# Altium schematic sheet JacdacRgbLedBar10 58.SchDoc: Complete design
size A4; DocumentNumber: 1; SheetNumber: 1; SheetTotal: 1; VersionControl_RevNumber: 1
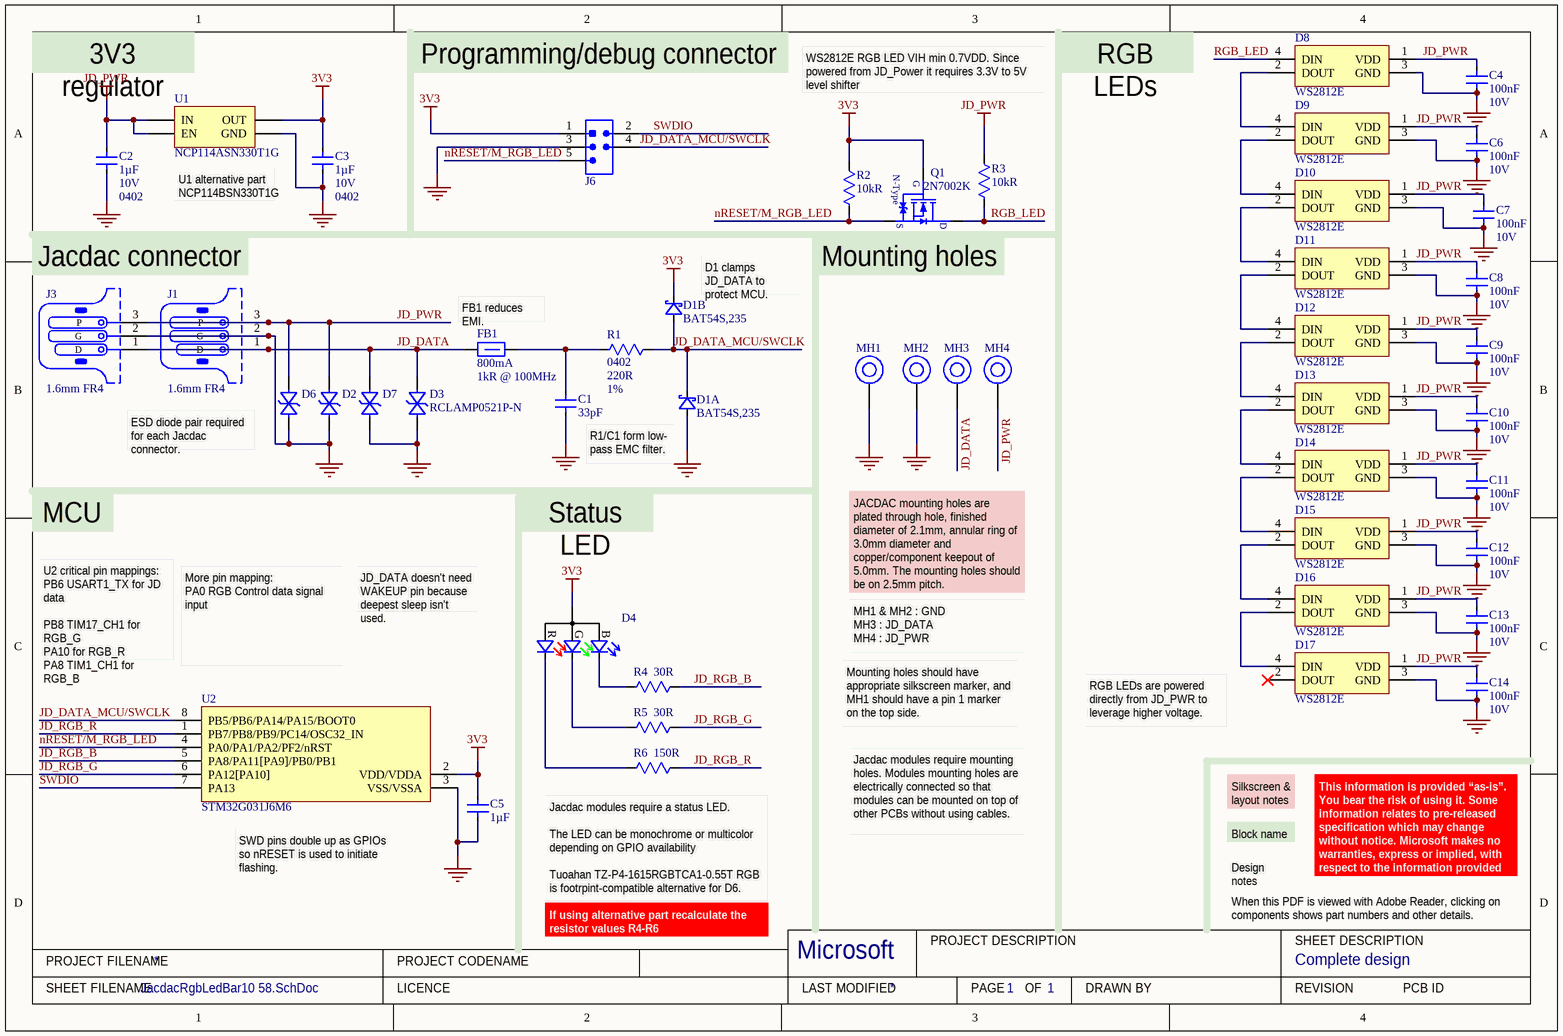
[diagram p0: JacdacRgbLedBar10 58.SchDoc]

## Parts
C1  Capacitance: 33pF  [C0402_0.55MM - without outline]  (hidden comment: CL05C330JB51PNC)
C2  Capacitance: 1µF  Voltage Rating: 10V  Case Code (Imperial): 0402  [C0402_0.55MM - without outline]  (hidden comment: CL05A105KP5NNNC)
C3  Capacitance: 1µF  Voltage Rating: 10V  Case Code (Imperial): 0402  [C0402_0.55MM - without outline]  (hidden comment: CL05A105KP5NNNC)
C4  Capacitance: 100nF  Voltage Rating: 10V  [C0402_0.55MM - without outline]  (hidden comment: CL05B104KP5NNNC)
C5  Capacitance: 1µF  [C0402_0.55MM - without outline]  (hidden comment: CL05A105KP5NNNC)
C6  Capacitance: 100nF  Voltage Rating: 10V  [C0402_0.55MM - without outline]  (hidden comment: CL05B104KP5NNNC)
C7  Capacitance: 100nF  Voltage Rating: 10V  [C0402_0.55MM - without outline]  (hidden comment: CL05B104KP5NNNC)
C8  Capacitance: 100nF  Voltage Rating: 10V  [C0402_0.55MM - without outline]  (hidden comment: CL05B104KP5NNNC)
C9  Capacitance: 100nF  Voltage Rating: 10V  [C0402_0.55MM - without outline]  (hidden comment: CL05B104KP5NNNC)
C10  Capacitance: 100nF  Voltage Rating: 10V  [C0402_0.55MM - without outline]  (hidden comment: CL05B104KP5NNNC)
C11  Capacitance: 100nF  Voltage Rating: 10V  [C0402_0.55MM - without outline]  (hidden comment: CL05B104KP5NNNC)
C12  Capacitance: 100nF  Voltage Rating: 10V  [C0402_0.55MM - without outline]  (hidden comment: CL05B104KP5NNNC)
C13  Capacitance: 100nF  Voltage Rating: 10V  [C0402_0.55MM - without outline]  (hidden comment: CL05B104KP5NNNC)
C14  Capacitance: 100nF  Voltage Rating: 10V  [C0402_0.55MM - without outline]  (hidden comment: CL05B104KP5NNNC)
D1  Manufacturer Part Number: BAT54S,235  [NXP-BAT54S-TO-236AB - without outline]  (hidden comment: BAT54S)  (parts A,B of 2)
D2  RCLAMP0521P-N  [TVS 0402 - without outline]  (value not drawn)
D3  RCLAMP0521P-N  [TVS 0402 - without outline]
D4  TZ-P4-1615RGBTCA1-0.55T  [TZ-P4-1615RGBTCA1-0.55T]  (value not drawn)
D6  RCLAMP0521P-N  [TVS 0402 - without outline]  (value not drawn)
D7  RCLAMP0521P-N  [TVS 0402 - without outline]  (value not drawn)
D8  WS2812E  [WS2812E-5050]
D9  WS2812E  [WS2812E-5050]
D10  WS2812E  [WS2812E-5050]
D11  WS2812E  [WS2812E-5050]
D12  WS2812E  [WS2812E-5050]
D13  WS2812E  [WS2812E-5050]
D14  WS2812E  [WS2812E-5050]
D15  WS2812E  [WS2812E-5050]
D16  WS2812E  [WS2812E-5050]
D17  WS2812E  [WS2812E-5050]
FB1  Current Rating: 800mA  Impedance: 1kR @ 100MHz  [TDK MPZ1608 0.8mm - without outline]  (hidden comment: TDK MPZ1608S102ATA00)
J1  PCB Type: 1.6mm FR4  [JACDAC_EDGE_CONNECTOR_NO_TRACES]  (hidden comment: 3 pin JACDAC edge connector)  (no BOM)
J3  PCB Type: 1.6mm FR4  [JACDAC_EDGE_CONNECTOR_NO_TRACES]  (hidden comment: 3 pin JACDAC edge connector)  (no BOM)
J6  Hack Connect Mini 1.27 mm pitch 2-row  [HACK_CONNECT_MINI_5_X_1_27]  (value not drawn)  (no BOM)
MH1  MH_5.0MMK_3.0MMC_2.1MMD_PTH  [MH_5.0MMK_3.0MMC_2.1MMD_PTH]  (value not drawn)  (no BOM)
MH2  MH_5.0MMK_3.0MMC_2.1MMD_PTH  [MH_5.0MMK_3.0MMC_2.1MMD_PTH]  (value not drawn)  (no BOM)
MH3  MH_5.0MMK_3.0MMC_2.1MMD_PTH  [MH_5.0MMK_3.0MMC_2.1MMD_PTH]  (value not drawn)  (no BOM)
MH4  MH_5.0MMK_3.0MMC_2.1MMD_PTH  [MH_5.0MMK_3.0MMC_2.1MMD_PTH]  (value not drawn)  (no BOM)
Q1  2N7002K  [SOT-23]
R1  Case Code (Imperial): 0402  Resistance: 220R  Tolerance: 1%  [R0402 - Without outline]  (hidden comment: RC0402FR-07220RL)
R2  Resistance: 10kR  [R0402 - Without outline]  (hidden comment: 10k)
R3  Resistance: 10kR  [R0402 - Without outline]  (hidden comment: 10k)
R4  Resistance: 30R  [R0402 - Without outline]  (hidden comment: RC0402FR-0730RL)
R5  Resistance: 30R  [R0402 - Without outline]  (hidden comment: RC0402FR-0730RL)
R6  Resistance: 150R  [R0402 - Without outline]  (hidden comment: RC0402FR-07150RL)
U1  LDO 3.3V/300 mA  [ON_SEMI-SOT23-5 - without outline]  (value not drawn)
U2  STM32G031J6M6  [8-SOIC]

## Nets
3V3: C3.2 C5.2 D1.2(K) D4.1(A) J6.1(VCC) Q1.1(G) R2.1 U1.5(OUT) U2.2(VDD/VDDA)
GND: C1.1 C2.1 C3.1 C4.1 C5.1 C6.1 C7.1 C8.1 C9.1 C10.1 C11.1 C12.1 C13.1 C14.1 D1.1(A) D2.2(A) D3.2(A) D6.2(A) D7.2(A) D8.3(GND) D9.3(GND) D10.3(GND) D11.3(GND) D12.3(GND) D13.3(GND) D14.3(GND) D15.3(GND) D16.3(GND) D17.3(GND) J1.2(G) J3.2(G) J6.3(GND) MH1.1 MH2.1 U1.2(GND) U2.3(VSS/VSSA)
JD_PWR: C2.2 C4.2 C6.2 C7.2 C8.2 C9.2 C10.2 C11.2 C12.2 C13.2 C14.2 D2.1(K) D6.1(K) D8.1(VDD) D9.1(VDD) D10.1(VDD) D11.1(VDD) D12.1(VDD) D13.1(VDD) D14.1(VDD) D15.1(VDD) D16.1(VDD) D17.1(VDD) J1.3(P) J3.3(P) MH4.1 R3.1 U1.1(IN) U1.3(EN)
JD_DATA: D3.1(K) D7.1(K) FB1.1 J1.1(D) J3.1(D) MH3.1
JD_DATA_MCU/SWCLK: D1.3(K) J6.4(SWCLK) R1.1 U2.8(PB5/PB6/PA14/PA15/BOOT0)
JD_RGB_B: R4.2 U2.5(PA8/PA11[PA9]/PB0/PB1)
JD_RGB_G: R5.2 U2.6(PA12[PA10])
JD_RGB_R: R6.2 U2.1(PB7/PB8/PB9/PC14/OSC32_IN)
nRESET/M_RGB_LED: J6.5(RESET) Q1.2(S) R2.2 U2.4(PA0/PA1/PA2/PF2/nRST)
RGB_LED: D8.4(DIN) Q1.3(D) R3.2
SWDIO: J6.2(SWDIO) U2.7(PA13)
NetC1_2: C1.2 FB1.2 R1.2
NetD4_2: D4.2(R) R6.1
NetD4_3: D4.3(G) R5.1
NetD4_4: D4.4(B) R4.1
NetD8_2: D8.2(DOUT) D9.4(DIN)
NetD9_2: D9.2(DOUT) D10.4(DIN)
NetD10_2: D10.2(DOUT) D11.4(DIN)
NetD11_2: D11.2(DOUT) D12.4(DIN)
NetD12_2: D12.2(DOUT) D13.4(DIN)
NetD13_2: D13.2(DOUT) D14.4(DIN)
NetD14_2: D14.2(DOUT) D15.4(DIN)
NetD15_2: D15.2(DOUT) D16.4(DIN)
NetD16_2: D16.2(DOUT) D17.4(DIN)

Not connected (* = marked no-connect by the designer): D17 2(DOUT)*

## Notes on the sheet
- (near U1) 3V3 regulator
- Programming/debug connector
- WS2812E RGB LED VIH min 0.7VDD. Since powered from JD_Power it requires 3.3V to 5V level shifter
- RGB LEDs
- U1 alternative part
  NCP114BSN330T1G
- Jacdac connector
- (near D1) D1 clamps JD_DATA to protect MCU.
- (near Q1) Mounting holes
- (near FB1) FB1 reduces EMI.
- (near D6) ESD diode pair required for each Jacdac connector.
- R1/C1 form low-
  pass EMC filter.
- MCU
- Status LED
- U2 critical pin mappings:
  PB6 USART1_TX for JD data
  PB8 TIM17_CH1 for RGB_G
  PA10 for RGB_R
  PA8 TIM1_CH1 for RGB_B
- JD_DATA doesn't need WAKEUP pin because deepest sleep isn't used.
- JACDAC mounting holes are plated through hole, finished diameter of 2.1mm, annular ring of 3.0mm diameter and copper/component keepout of 5.0mm. The mounting holes should be on 2.5mm pitch.
- MH1 & MH2 : GND
  MH3 : JD_DATA
  MH4 : JD_PWR
- More pin mapping:
  PA0 RGB Control data signal input
- Mounting holes should have appropriate silkscreen marker, and MH1 should have a pin 1 marker on the top side.
- RGB LEDs are powered directly from JD_PWR to leverage higher voltage.
- Jacdac modules require mounting holes. Modules mounting holes are electrically connected so that modules can be mounted on top of other PCBs without using cables.
- Block name
- Silkscreen & layout notes
- (near U2) SWD pins double up as GPIOs so nRESET is used to initiate flashing.
- Tuoahan TZ-P4-1615RGBTCA1-0.55T RGB is footrpint-compatible alternative for D6.
- (near R6) Jacdac modules require a status LED.
  The LED can be monochrome or multicolor depending on GPIO availability
- Design notes
- When this PDF is viewed with Adobe Reader, clicking on components shows part numbers and other details.
- This information is provided “as-is”. You bear the risk of using it. Some information relates to pre-released specification which may change without notice. Microsoft makes no warranties, express or implied, with respect to the information provided here.
- If using alternative part recalculate the resistor values R4-R6
- PROJECT FILENAME
- PROJECT CODENAME
- Microsoft
- PROJECT DESCRIPTION
- SHEET DESCRIPTION
- SHEET FILENAME
- LICENCE
- LAST MODIFIED
- PAGE
- OF
- DRAWN BY
- REVISION
- PCB ID
- (in symbol 2N7002K (2)) N-Type

## Library data of the parts
C1 = CL05C330JB51PNC: CAP CER 33PF 50V NP0 0402; Manufacturer: Samsung; Tolerance: 5%; Supplier 1: Digi-Key; Manufacturer Part Number: CL05C330JB51PNC; RoHS: Yes; Category: Capacitors; Stock 1: 250654; Pricing 1: 1=0.10000, 10=0.07500, 50=0.04060, 100=0.03320, 500=0.02374, 1000=0.01865, 2500=0.01696, 5000=0.01560 (USD); Mount: Surface Mount; Case/Package: 0402; Case Code (Metric): 1005; Min Operating Temperature: -55°C; Max Operating Temperature: 125°C; Packaging: Tape and Reel; Length: 0.039inch; Width: 0.02inch; Thickness: 0.022inch; Ratings: AEC-Q200; Lead Free: Lead Free; ComponentLink1URL: http://www.samsungsem.com/kr/support/library/product-catalog/mlcc.jsp; ComponentLink1Description: Samsung datasheet online; Supplier 2: Mouser; Stock 2: 97900; Pricing 2: 1=0.11000, 10=0.08200, 100=0.03600, 500=0.02600, 1000=0.02000, 2500=0.01800 (USD); Supplier 3: Future Electronics; Stock 3: 100000; Pricing 3: 10000=0.00780 (USD); Supplier Part Number 3: 6022520; Supplier Part Number 2: 187-CL05C330JB51PNC; Checked: ?; Created: DG; Supplier Part Number 1: 1276-6515-1-ND; Voltage Rating: 50V; Case Code (Imperial): 0402
C2 C3 C5 = CL05A105KP5NNNC: CAP CER 1UF 10V X5R 0402; Manufacturer: Samsung; Material: Ceramic; Tolerance: 10%; Supplier 1: Digi-Key; Manufacturer Part Number: CL05A105KP5NNNC; RoHS: Yes; Category: Capacitors; Stock 1: 5705569; Pricing 1: 1=0.10000, 10=0.03900, 50=0.02100, 100=0.01720, 500=0.01228, 1000=0.00965, 2500=0.00877, 5000=0.00807 (USD); Mount: Surface Mount; Case/Package: 0402; Case Code (Metric): 1005; Contact Plating: Tin; Min Operating Temperature: -55°C; Max Operating Temperature: 85°C; Dielectric: X5R; Package Quantity: 1; Packaging: Tape and Reel; Length: 1mm; Height: 0.5mm; Width: 0.02inch; Thickness: 0.022inch; Depth: 0.5mm; Radiation Hardening: No; ComponentLink1URL: https://datasheet.ciiva.com/15195/getdatasheetpartid-358390-15195630.pdf; ComponentLink1Description: Online datasheet; Supplier 2: Mouser; Stock 2: 928941; Pricing 2: 1=0.10000, 10=0.04200, 100=0.01800, 500=0.01300, 1000=0.01000, 2500=0.00900 (USD); Supplier 3: Farnell; Stock 3: 53670; Pricing 3: 10=0.02450, 100=0.02000, 500=0.01310, 2500=0.00920, 5000=0.00810, 10000=0.00640, 50000=0.00490 (GBP); Supplier Part Number 3: 3013329; Supplier Part Number 2: 187-CL05A105KP5NNNC; Supplier Part Number 1: 1276-1076-1-ND; Created: DG; Checked: ?
  C5: Voltage Rating: 10V; Case Code (Imperial): 0402
C4 C6-C14 = CL05B104KP5NNNC: CAP CER 0.1UF 10V X7R 0402; Manufacturer: Samsung; Tolerance: 10%; Supplier 1: Digi-Key; Manufacturer Part Number: CL05B104KP5NNNC; RoHS: Yes; Category: Ceramic Capacitors; Stock 1: 17321183; Pricing 1: 1=0.10000, 10=0.02500, 50=0.01380, 100=0.01130, 500=0.00804, 1000=0.00632, 2500=0.00575, 5000=0.00529 (USD); Mount: Surface Mount; Case/Package: 0402; Case Code (Imperial): 0402; Case Code (Metric): 1005; Contact Plating: Tin; Min Operating Temperature: -55°C; Max Operating Temperature: 125°C; Package Quantity: 1; Packaging: Tape and Reel; Dielectric: X7R; Length: 1mm; Width: 0.02inch; Height: 0.5mm; Thickness: 0.022inch; Depth: 0.5mm; Radiation Hardening: No; ComponentLink1URL: https://datasheet.ciiva.com/15165/getdatasheetpartid-37100-15165107.pdf; ComponentLink1Description: Samsung datasheet online; Supplier 2: Mouser; Stock 2: 984124; Pricing 2: 10000=0.00400, 20000=0.00400, 50000=0.00400 (USD); Supplier 3: Farnell; Stock 3: 39022; Pricing 3: 10=0.01620, 100=0.01310, 500=0.00740, 2500=0.00600, 5000=0.00470, 10000=0.00400, 50000=0.00320 (GBP); Supplier 4: Newark; Stock 4: 56730; Pricing 4: 1=0.09000, 25=0.02300, 100=0.01000, 250=0.00900, 500=0.00700, 1000=0.00500, 2500=0.00500 (USD); Supplier 5: Future Electronics; Stock 5: 20877033; Pricing 5: 1=0.00460, 500=0.00340, 1500=0.00320, 2500=0.00310, 5000=0.00300 (USD); Supplier Part Number 5: 9032525; Supplier Part Number 4: 82AC9219; Supplier Part Number 2: 187-CL05B104KP5NNNC; Supplier Part Number 1: 1276-1002-1-ND; Created: DG; Checked: ?; Supplier Part Number 3: 3013351
D1 = BAT54S: DIODE ARRAY SCHOTTKY 30V SOT23; Manufacturer: Nexperia; Supplier 1: Digi-Key; RoHS: No; Category: Rectifier Diodes; Stock 1: 14011; Pricing 1: 1=0.13000, 10=0.11900, 100=0.05610, 500=0.03326, 1000=0.02185, 5000=0.02138 (USD); ComponentLink1URL: https://assets.nexperia.com/documents/data-sheet/BAT54_SER.pdf; ComponentLink1Description: NXP datasheet online; Supplier 2: Mouser; Supplier 3: RSComponents; Supplier Part Number 2: 771-BAT54S235; Supplier Part Number 3: 1707990; Supplier Part Number 1: 1727-1868-1-ND
D2 D3 D6 D7 = RCLAMP0521P-N: Bidirectional 5V (Max) 6V 16V 3.5A (8/20us) 0402 TVS RoHS; Manufacturer: Born Semiconductor; Package: 0402; Created By: D Gakure; Checked By: ?; Supplier1: LCSC; Supplier1 Part Number: C316043; ComponentLink1Description: Online datasheet; ComponentLink1URL: https://datasheet.lcsc.com/szlcsc/Bourne-Semicon-Shenzhen-RCLAMP0521P-N_C316043.pdf; Manufacturer Part Number: RCLAMP0521P-N
D4 = TZ-P4-1615RGBTCA1-0.55T: 1615 Light Emitting Diodes (LED) RoHS; Manufacturer: TUOZHAN; Manufacturer Part Number: TZ-P4-1615RGBTCA1-0.55T; Category: Optoelectronics; Package: 1615; ComponentLink1Description: Online datasheet; ComponentLink1URL: https://datasheet.lcsc.com/szlcsc/2009041238_TUOZHAN-TZ-P4-1615RGBTCA1-0-55T_C779813.pdf; RoHS: RoHS Compliant; Supplier 1: LCSC; Size / Dimension: 1.6x1.5mm; Supplier 1 Part Number: C779813; Packaging: Tape & Reel (TR); Created By: D. Gakure; Checked By: ?
D8-D17 = WS2812E-5050: WS2812E 5050 RGB LED WITH INTEGRATED DRIVER; Manufacturer: Worldsemi; Color: Blue,Green,Red; Supplier 1 Part Number 3: C139127; RoHS: Yes; Category: LEDs; Mount: Surface Mount; Length: 5mm; Width: 5mm; ComponentLink1URL: https://datasheet.lcsc.com/lcsc/1811151230_Worldsemi-WS2812E_C139127.pdf; ComponentLink1Description: Online datasheet; Supplier 1: LCSC; Manufacturer Part Number: WS2812E
FB1 = TDK MPZ1608S102ATA00: 0603 1k@100MHz 0.8A chip; Core Material: Ferrite; Tolerance: 25%; DC Resistance (DCR): 300mR; Supplier 1: Digi-Key; Stock 1: 113542; Pricing 1: 1=0.1, 10=0.079, 25=0.0716, 50=0.0644, 100=0.0472, 250=0.03432, 500=0.03146, 1000=0.02717 (USD); Mount: Surface Mount; Case/Package: 0603; Case Code (Metric): 1608; Case Code (Imperial): 0603; Package Quantity: 4000; Packaging: Tape and Reel; Max DC Current: 800mA; Length: 0.063inch; Height: 0.037inch; Width: 0.031inch; ComponentLink2URL: https://www.mouser.co.uk/datasheet/2/400/eads_commercial_power_mpz1608_en-923650.pdf; ComponentLink2Description: datasheet online; Supplier 2: Mouser; ComponentLink3Description: datasheet; ComponentLink3URL: Y:\System\Altium\Libraries 2014\TDK\Datasheets\eads_commercial_power_mpz1608_en-923650.pdf; Supplier Part Number 1: 445-8694-1-ND; Supplier Part Number 2: 810-MPZ1608S102ATA00; Manufacturer: TDK; Manufacturer Part Number: MPZ1608S102ATA00
J1 J3 = JACDAC edge connector: 3 pin JACDAC edge connector 1.27mm pitch; Manufacturer Part Number: JACDAC_EDGE_CONNECTOR; Checked By: ?; Created By: D. Gakure; ComponentLink1Description: Yuliang JACDAC cable connector drawing online; ComponentLink1URL: https://github.com/microsoft/jacdac-mdk/blob/main/connector/JACDAC-Connector-by-Yuliang-2020-11-28.pdf; ComponentLink2Description: JACDAC PCB edge connector spec onlin; ComponentLink2URL: https://github.com/microsoft/jacdac-mdk/blob/main/connector/JACDAC_PCB_Edge_Connector_Drawing_JD-PEC-01_rev_01.pdf
J6 = HACK_CONNECT_MINI
MH1-MH4 = MH_5.0MMK_3.0MMC_2.1MMD_PTH: Mounting Hole 5.0mm keepout, 3.0mm annualar ring and 2.1mm Drill PTH
Q1 = 2N7002K (2): MOSFET Transistor, N Channel, 300 mA, 60 V, 2 ohm, 10 V, 2.5 V; Manufacturer: ON Semiconductor / Fairchild; Continuous Drain Current (ID): 300mA; Power Dissipation: 350mW; Gate to Source Voltage (Vgs): 20V; Input Capacitance: 50pF; Drain to Source Resistance: 2R; Turn-Off Delay Time: 30ns; Drain to Source Breakdown Voltage: 60V; Number of Elements: 1; Turn-On Delay Time: 5ns; Element Configuration: Single; Threshold Voltage: 2.5V; Polarity: N-CHANNEL; Supplier 1: Digi-Key; RoHS: Yes; Category: MOSFETs; Stock 1: 53564; Pricing 1: 1=0.40000, 10=0.32500, 25=0.27240, 100=0.17240, 500=0.11344, 1000=0.07714 (USD); Mount: Surface Mount; Case/Package: SOT-23; Number of Pins: 3; Contact Plating: Tin,Matte; Min Operating Temperature: -55°C; Max Operating Temperature: 150°C; Packaging: Tape and Reel; Max Power Dissipation: 350mW; Package Quantity: 1; Rds On Max: 2R; Drain to Source Voltage (Vdss): 60V; On-State Resistance: 2R; Drain-source On Resistance-Max: 2R; Voltage: 60V; Length: 2.92mm; Width: 1.3mm; Height: 1.2mm; Radiation Hardening: No; Lead Free: Lead Free; REACH SVHC: No SVHC; Supplier 2: Mouser; Stock 2: 111825; Pricing 2: 1=0.40000, 10=0.27300, 50=0.27300, 100=0.13400, 1000=0.07800, 10000=0.05100 (USD); Supplier 3: Farnell; Stock 3: 101059; Pricing 3: 5=0.34800, 10=0.23500, 100=0.09100, 500=0.05850, 3000=0.04630, 9000=0.03860, 24000=0.03750, 45000=0.03530 (GBP); Supplier Part Number 3: 2453382; Supplier Part Number 1: 2N7002KCT-ND; Supplier Part Number 2: 512-2N7002K; Created By: D. Gakure; Checked By: ?; ComponentLink1Description: Online datasheet; ComponentLink1URL: https://www.onsemi.com/pdf/datasheet/2n7002k-d.pdf; Manufacturer Part Number: 2N7002K
R1 = RC0402FR-07220RL: RES SMD 220 OHM 1% 1/16W 0402; Manufacturer: Yageo; Power Rating: 62.5mW; Voltage Rating: 50V; Temperature Coefficient: 100ppm/°C; Max Power Dissipation: 63mW; Supplier 1: Digi-Key; Manufacturer Part Number: RC0402FR-07220RL; RoHS: Yes; Category: Resistors; Stock 1: 1286042; Pricing 1: 1=0.10000, 10=0.01400, 100=0.00580, 1000=0.00262, 2500=0.00228, 5000=0.00188 (USD); Case/Package: 0402; Number of Pins: 2; Case Code (Metric): 1005; Min Operating Temperature: -55°C; Max Operating Temperature: 155°C; Packaging: Tape and Reel; Voltage Rating (DC): 50V; Package Quantity: 1; Termination: SMD/SMT; Resistor Type: Thick Film; Number of Terminations: 2; Features: Moisture Resistant; Length: 1mm; Height: 0.016inch; Width: 0.02inch; Depth: 0.5mm; REACH SVHC: No SVHC; Military Standard: Not; Lead Free: Lead Free; ComponentLink1URL: https://datasheet.ciiva.com/11819/0900766b80c66297-11819466.pdf; ComponentLink1Description: Online datasheet; Supplier 2: Mouser; Stock 2: 324625; Pricing 2: 1=0.10000, 10=0.01200, 100=0.00400, 1000=0.00400, 2500=0.00400, 10000=0.00300 (USD); Supplier 3: Farnell; Stock 3: 18234; Pricing 3: 1=0.08130, 25=0.01210, 100=0.01120, 250=0.01030, 500=0.00900 (GBP); Supplier Part Number 3: 2147864; Supplier Part Number 2: 603-RC0402FR-07220RL; Supplier Part Number 1: 311-220LRCT-ND; Created: D.G; Checked: ?
R2 R3 = RC0402FR-0710KL: RES SMD 10K OHM 1% 1/16W 0402; Manufacturer: Yageo; Temperature Coefficient: 100ppm/°C; Voltage Rating (DC): 50V; Power Rating: 62.5mW; Supplier 1: Digi-Key; Manufacturer Part Number: RC0402FR-0710KL; RoHS: Yes; Category: Resistors; Stock 1: 40173593; Pricing 1: 1=0.10000, 10=0.01400, 100=0.00580, 1000=0.00262, 2500=0.00228, 5000=0.00188 (USD); Case/Package: 0402; Number of Pins: 2; Case Code (Metric): 1005; Min Operating Temperature: -55°C; Max Operating Temperature: 155°C; Resistor Type: Thick Film; Packaging: Tape and Reel; Voltage Rating: 50V; Termination: SMD/SMT; Working Voltage: 50V; Number of Terminations: 2; Length: 1mm; Height: 0.32mm; Width: 0.5mm; Depth: 0.5mm; Lead Pitch: 0.2mm; REACH SVHC: No SVHC; Lead Free: Lead Free; Military Standard: Not; ComponentLink1URL: https://datasheet.ciiva.com/7660/38568-7660787.pdf?src-supplier=Element14; ComponentLink1Description: https://datasheet.ciiva.com/7660/38568-7660787.pdf?src-supplier=Element14; ComponentLink2URL: https://datasheet.ciiva.com/7849/1784430-7849813.pdf?src-supplier=Element14; ComponentLink2Description: https://datasheet.ciiva.com/7849/1784430-7849813.pdf?src-supplier=Element14; ComponentLink3URL: https://datasheet.ciiva.com/7849/1686128-7849814.pdf?src-supplier=Element14; ComponentLink3Description: https://datasheet.ciiva.com/7849/1686128-7849814.pdf?src-supplier=Element14; ComponentLink4URL: https://datasheet.ciiva.com/7849/1784430-7849815.pdf?src-supplier=Element14; ComponentLink4Description: https://datasheet.ciiva.com/7849/1784430-7849815.pdf?src-supplier=Element14; ComponentLink5URL: https://datasheet.ciiva.com/22747/1018594-22747512.pdf?src-supplier=Element14; ComponentLink5Description: https://datasheet.ciiva.com/22747/1018594-22747512.pdf?src-supplier=Element14; ComponentLink6URL: https://datasheet.ciiva.com/12667/pyu-rc0402-51-rohs-l-6-r-12667067.pdf?src-supplier=Mouser; ComponentLink6Description: https://datasheet.ciiva.com/12667/pyu-rc0402-51-rohs-l-6-r-12667067.pdf?src-supplier=Mouser; ComponentLink7URL: https://datasheet.ciiva.com/7983/1018594-7983486.pdf?src-supplier=Element14; ComponentLink7Description: https://datasheet.ciiva.com/7983/1018594-7983486.pdf?src-supplier=Element14; Supplier 2: Mouser; Stock 2: 23672167; Pricing 2: 1=0.10000, 10=0.01300, 100=0.00400, 1000=0.00300, 2500=0.00300, 10000=0.00200 (USD); Supplier 3: Farnell; Stock 3: 370000; Pricing 3: 10000=0.00350 (GBP); Checked: ?; Created: DG; Supplier Part Number 1: 311-10.0KLRCT-ND; Supplier Part Number 2: 603-RC0402FR-0710KL; Supplier Part Number 3: 2363463; Tolerance: 1%; Case Code (Imperial): 0402
R4 R5 = RC0402FR-0730RL: RES SMD 30 OHM 1% 1/16W 0402; Manufacturer: Yageo; Temperature Coefficient: 100ppm/°C; Power Rating: 63mW; Voltage Rating: 50V; Supplier 1: Digi-Key; Manufacturer Part Number: RC0402FR-0730RL; RoHS: Yes; Category: Chip SMD Resistors; Stock 1: 2973; Pricing 1: 1=0.10000, 10=0.01400, 100=0.00580, 1000=0.00260, 2500=0.00226, 5000=0.00186 (USD); Case/Package: 0402; Contact Plating: Tin,Matte; Case Code (Metric): 1005; Size Code: 0402; Min Operating Temperature: -55°C; Max Operating Temperature: 155°C; Resistor Type: Thick Film; Packaging: Tape and Reel; Termination: SMD/SMT; Voltage Rating (DC): 50V; Features: Moisture Resistant; Series: RC; Max Power Dissipation: 63mW; Number of Terminations: 2; Construction: Rectangular; Resistance Tolerance: 1%; Length: 1mm; Width: 0.5mm; Height: 0.35mm; Depth: 0.5mm; REACH SVHC: Unknown; Military Standard: Not; Lead Free: Lead Free; RoHS Compliant: Yes; ComponentLink1URL: https://datasheet.ciiva.com/7849/1018594-7849958.pdf; ComponentLink1Description: Online datasheet; Supplier 2: Mouser; Stock 2: 41804; Pricing 2: 1=0.10000, 10=0.01200, 50=0.01200, 100=0.00400, 1000=0.00400, 10000=0.00300 (USD); Supplier 3: Farnell; Stock 3: 4422; Pricing 3: 10=0.01210, 100=0.00420, 500=0.00370, 2500=0.00280, 5000=0.00250, 10000=0.00230, 50000=0.00150 (GBP); Supplier Part Number 3: 1458775; Supplier Part Number 2: 603-RC0402FR-0730RL; Supplier Part Number 1: 311-30LRCT-ND; Created By: D. Gakure; Checked By: ?; Tolerance: 1%; Case Code (Imperial): 0402
R6 = RC0402FR-07150RL: RES SMD 150 OHM 1% 1/16W 0402; Manufacturer: Yageo; Power Rating: 62.5mW; Voltage Rating: 50V; Temperature Coefficient: 100ppm/°C; Max Power Dissipation: 63mW; Supplier 1: Digi-Key; Manufacturer Part Number: RC0402FR-07150RL; RoHS: Yes; Category: Chip SMD Resistors; Stock 1: 5214533; Pricing 1: 1=0.10000, 10=0.01400, 100=0.00580, 1000=0.00260, 2500=0.00226, 5000=0.00186 (USD); Case/Package: 0402; Case Code (Metric): 1005; Min Operating Temperature: -55°C; Max Operating Temperature: 155°C; Packaging: Tape and Reel; Package Quantity: 1; Resistor Type: Thick Film; Number of Terminations: 2; Termination: SMD/SMT; Working Voltage: 50V; Features: Moisture Resistant; Series: RC; Resistance Tolerance: 1%; Construction: Rectangular; Technology: THICK FILM; Length: 1mm; Width: 0.02inch; Height: 0.016inch; Depth: 0.5mm; REACH SVHC: No SVHC; Military Standard: Not; Lead Free: Lead Free; RoHS Compliant: Yes; ComponentLink1URL: https://datasheet.ciiva.com/11808/0900766b80c66297-11808422.pdf; ComponentLink1Description: ine datasheet; Supplier 2: Mouser; Stock 2: 582717; Pricing 2: 1=0.10000, 10=0.01200, 50=0.01200, 100=0.00400, 1000=0.00400, 10000=0.00300 (USD); Supplier 3: Farnell; Stock 3: 880000; Pricing 3: 10000=0.00270, 50000=0.00200 (GBP); Created by: D. Gakure; Checked By: ?; Supplier Part Number 3: 2421893; Supplier Part Number 2: 603-RC0402FR-07150RL; Supplier Part Number 1: 311-150LRCT-ND; Tolerance: 1%; Case Code (Imperial): 0402
U1 = NCP114ASN330T1G: ON SEMICONDUCTOR - NCP114ASN330T1G - LDO Voltage Regulator, Fixed, 1.7 V to 5.5 V in, 3.3 V/300 mA out, 150 mV drop, TSOP-5; Output Current: 300mA; Output Configuration: Positive; Number of Regulators: 1; Max Input Voltage: 5.5V; Min Output Voltage: 3.3V; Dropout Voltage: 225mV; Quiescent Current: 95uA; Power Supply Rejection Ratio (PSRR): 75dB; Supplier 1: Digi-Key; RoHS: No; Category: Voltage Regulators - Linear; Stock 1: 32529; Pricing 1: 1=0.33000, 10=0.24900, 25=0.21760, 100=0.12440, 250=0.11664, 500=0.09330, 1000=0.07153 (USD); Mount: Surface Mount; Case/Package: SOT-23-5; Min Operating Temperature: -40°C; Max Operating Temperature: 85°C; Output Type: Fixed; Packaging: Cut Tape; Lead Free: Lead Free; ComponentLink3URL: http://www.onsemi.com/pub/Collateral/NCP114-D.PDF; ComponentLink3Description: On Semi datasheet online; Supplier 2: RSComponents; Supplier 3: Mouser; Supplier Part Number 3: 863-NCP114ASN330T1G; Supplier Part Number 2: 1263178; Supplier Part Number 1: NCP114ASN330T1GOSCT-ND; Created: DG; Checked: ?; Manufacturer: ON Semiconductor; Manufacturer Part Number: NCP114ASN330T1G
U2 = STM32G031J6M6: MCU 32-bit ARM Cortex M0+ RISC 32KB Flash 2.5V/3.3V 8-Pin SO N Tube; Manufacturer: STMicroelectronics; Supplier 1: Digi-Key; RoHS: Yes; Category: Microcontrollers; Pricing 1: 1=1.80000, 10=1.61600, 25=1.52480, 100=1.29920, 250=1.21992, 500=1.06744, 1000=0.88952 (USD); Supplier 2: Future Electronics; Pricing 2: 1=1.91000, 25=1.70000, 75=1.63000, 150=1.59000, 400=1.53000 (USD); Supplier 3: Mouser; Pricing 3: 1=1.50000, 10=1.28000, 50=1.28000, 100=1.09000, 1000=0.73700, 10000=0.71100 (USD); Supplier Part Number 3: 511-STM32G031J6M6; Supplier Part Number 2: 2116576; Supplier Part Number 1: 497-19552-ND; Created By: D. Gakure; Checked By: ?; ComponentLink1Description: Online datasheet; ComponentLink1URL: https://www.st.com/resource/en/datasheet/stm32g031c6.pdf; Manufacturer Part Number: STM32G031J6M6